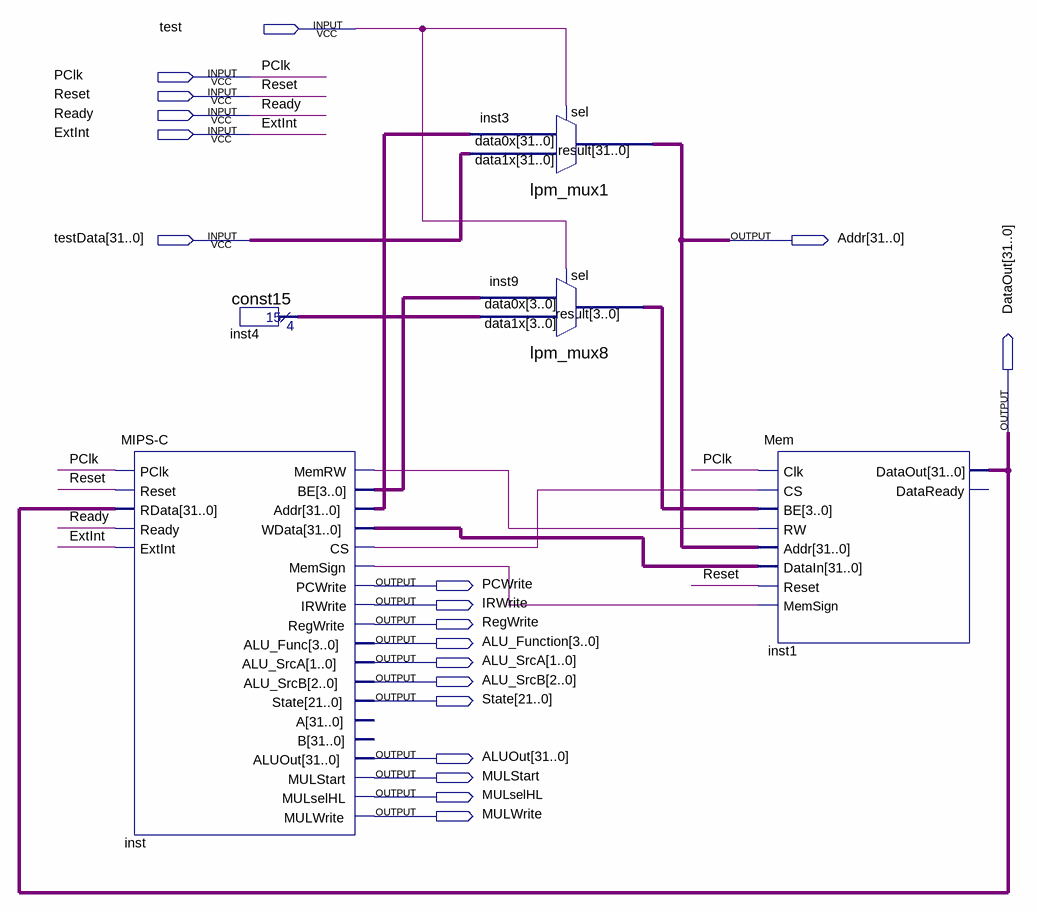
[diagram p0: schematic sheet]
// Quartus schematic CPU.bdf as structural Verilog: 5 symbols, 19 pins
module CPU (
  input  test,
  input  PClk,
  input  Reset,
  input  Ready,
  input  ExtInt,
  input  [31:0] testData,
  output [31:0] Addr,
  output [31:0] DataOut,
  output PCWrite,
  output IRWrite,
  output RegWrite,
  output [3:0] ALU_Function,
  output [1:0] ALU_SrcA,
  output [2:0] ALU_SrcB,
  output [21:0] State,
  output [31:0] ALUOut,
  output MULStart,
  output MULselHL,
  output MULWrite
);

  wire inst_cs, inst_memrw, inst_memsign;
  wire [3:0] inst4_result, inst9_result, inst_be;
  wire [31:0] inst_addr, inst_wdata;

  \MIPS-C  inst (
    .PClk(PClk), .Reset(Reset), .RData(DataOut), .Ready(Ready), .ExtInt(ExtInt), .MemRW(inst_memrw),
    .BE(inst_be), .Addr(inst_addr), .WData(inst_wdata), .CS(inst_cs), .MemSign(inst_memsign),
    .PCWrite(PCWrite), .IRWrite(IRWrite), .RegWrite(RegWrite), .ALU_Func(ALU_Function), .ALU_SrcA(ALU_SrcA),
    .ALU_SrcB(ALU_SrcB), .State(State), .ALUOut(ALUOut), .MULStart(MULStart), .MULselHL(MULselHL),
    .MULWrite(MULWrite));  // open: A, B
  const15 inst4 (.result(inst4_result));
  lpm_mux1 inst3 (.data1x(testData), .data0x(inst_addr), .sel(test), .result(Addr));
  lpm_mux8 inst9 (.data1x(inst4_result), .data0x(inst_be), .sel(test), .result(inst9_result));
  Mem inst1 (
    .Clk(PClk), .CS(inst_cs), .BE(inst9_result), .RW(inst_memrw), .Addr(Addr), .DataIn(inst_wdata),
    .Reset(Reset), .MemSign(inst_memsign), .DataOut(DataOut));  // open: DataReady
endmodule
